# Altium schematic sheet PhotoResistor.SchDoc
size A
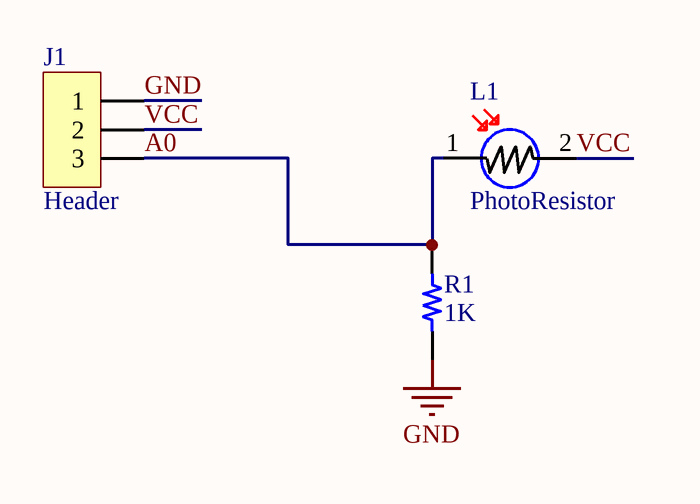
[diagram p0: PhotoResistor.SchDoc]

## Parts
J1  Header  [MOLEX SDA-70553-3PIN]
L1  PhotoResistor  [PhotoResistor]
R1  1K  [RES 1206/3216]

## Nets
GND: J1.1 R1.1
A0: J1.3 L1.1 R1.2
VCC: J1.2 L1.2

## Library data of the parts
J1 = 3 Pin
R1 = Resistor: SMT Resistor; Value: 1K